# Altium schematic sheet MCU.SchDoc: Mini Editor Keyboard
size A3; DrawnBy: Roman Sklyar; Organization: S-LAB; Address1: Russian Federation; Address2: Sergiev Posad; DocumentNumber: 2; Revision: v1.0; SheetNumber: 2; SheetTotal: 6
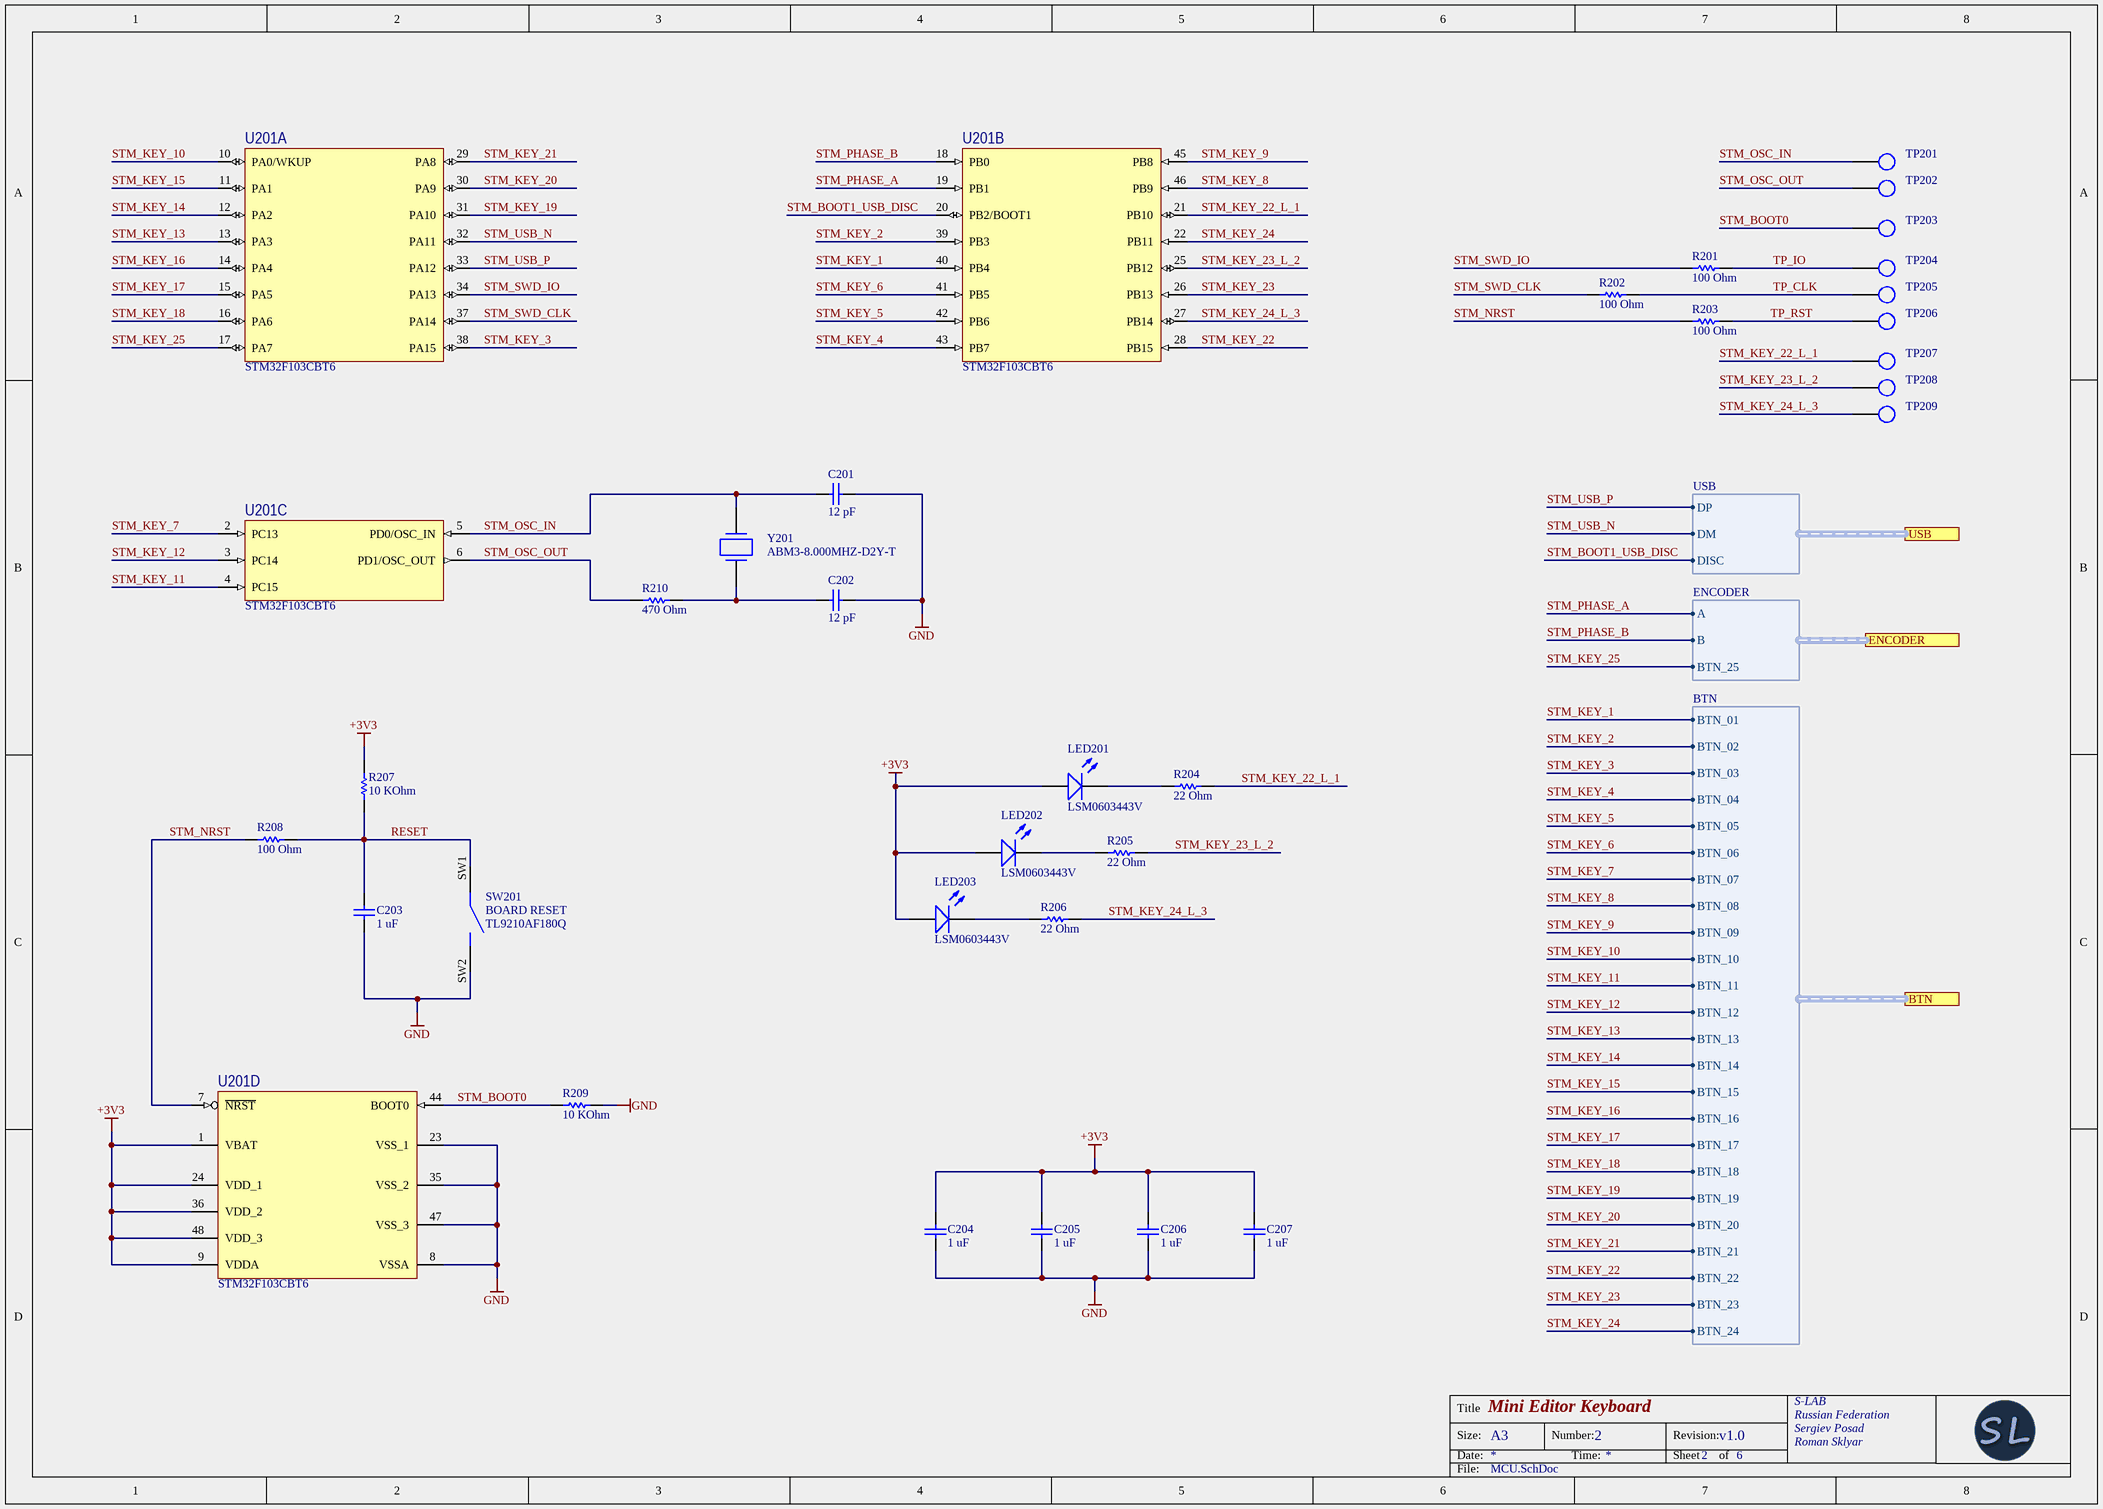
[diagram p0: MCU.SchDoc]

## Parts
C201  Capacitance: 12 pF  [CAPC0603]  (hidden comment: CAP-12P)
C202  Capacitance: 12 pF  [CAPC0603]  (hidden comment: CAP-12P)
C203  Capacitance: 1 uF  [CAPC0805]  (hidden comment: CAP-1U)
C204  Capacitance: 1 uF  [CAPC0805]  (hidden comment: CAP-1U)
C205  Capacitance: 1 uF  [CAPC0805]  (hidden comment: CAP-1U)
C206  Capacitance: 1 uF  [CAPC0805]  (hidden comment: CAP-1U)
C207  Capacitance: 1 uF  [CAPC0805]  (hidden comment: CAP-1U)
LED201  LSM0603443V  [LSM0603-Series]
LED202  LSM0603443V  [LSM0603-Series]
LED203  LSM0603443V  [LSM0603-Series]
R201  Resistance: 100 Ohm  [RES0603]  (hidden comment: RES-100)
R202  Resistance: 100 Ohm  [RES0603]  (hidden comment: RES-100)
R203  Resistance: 100 Ohm  [RES0603]  (hidden comment: RES-100)
R204  Resistance: 22 Ohm  [RES0603]  (hidden comment: RES-22)
R205  Resistance: 22 Ohm  [RES0603]  (hidden comment: RES-22)
R206  Resistance: 22 Ohm  [RES0603]  (hidden comment: RES-22)
R207  Resistance: 10 KOhm  [RES0603]  (hidden comment: RES-10K)
R208  Resistance: 100 Ohm  [RES0603]  (hidden comment: RES-100)
R209  Resistance: 10 KOhm  [RES0603]  (hidden comment: RES-10K)
R210  Resistance: 470 Ohm  [RES0603]  (hidden comment: RES-470)
SW201  BOARD RESET  [TL9210AF180Q]
TP201  (no value)  [TP_C-0.5mm]  (no BOM)
TP202  (no value)  [TP_C-0.5mm]  (no BOM)
TP203  (no value)  [TP_C-0.5mm]  (no BOM)
TP204  (no value)  [TP_C-0.5mm]  (no BOM)
TP205  (no value)  [TP_C-0.5mm]  (no BOM)
TP206  (no value)  [TP_C-0.5mm]  (no BOM)
TP207  (no value)  [TP_C-0.5mm]  (no BOM)
TP208  (no value)  [TP_C-0.5mm]  (no BOM)
TP209  (no value)  [TP_C-0.5mm]  (no BOM)
U201  STM32F103CBT6  [LQFP-48-STM32]  (parts A,B,C,D of 4)
Y201  ABM3-8.000MHZ-D2Y-T  [ABM3-2P]

## Ports
BTN (harness BTN), ENCODER (harness ENCODER), USB (harness USB)

## Harnesses
BTN: BTN_10, BTN_11, BTN_09, BTN_12, BTN_13, BTN_14, BTN_15, BTN_16, BTN_17, BTN_18, BTN_19, BTN_08, BTN_07, BTN_06, BTN_05, BTN_04, BTN_03, BTN_02, BTN_01, BTN_20, BTN_21, BTN_22, BTN_23, BTN_24
USB: DP, DM, DISC
ENCODER: A, B, BTN_25

## Nets
+3V3: C204.2 C205.2 C206.2 C207.2 LED201.2(A) LED202.2(A) LED203.2(A) R207.2 U201.1(VBAT) U201.9(VDDA) U201.24(VDD_1) U201.36(VDD_2) U201.48(VDD_3)
GND: C201.1 C202.1 C203.2 C204.1 C205.1 C206.1 C207.1 R209.2 SW201.SW2 U201.8(VSSA) U201.23(VSS_1) U201.35(VSS_2) U201.47(VSS_3)
RESET: C203.1 R207.1 R208.2 SW201.SW1
STM_BOOT0: R209.1 TP203.1 U201.44(BOOT0)
STM_BOOT1_USB_DISC: U201.20(PB2/BOOT1) ; port USB.DISC
STM_KEY_1: U201.40(PB4) ; port BTN.BTN_01
STM_KEY_2: U201.39(PB3) ; port BTN.BTN_02
STM_KEY_3: U201.38(PA15) ; port BTN.BTN_03
STM_KEY_4: U201.43(PB7) ; port BTN.BTN_04
STM_KEY_5: U201.42(PB6) ; port BTN.BTN_05
STM_KEY_6: U201.41(PB5) ; port BTN.BTN_06
STM_KEY_7: U201.2(PC13) ; port BTN.BTN_07
STM_KEY_8: U201.46(PB9) ; port BTN.BTN_08
STM_KEY_9: U201.45(PB8) ; port BTN.BTN_09
STM_KEY_10: U201.10(PA0/WKUP) ; port BTN.BTN_10
STM_KEY_11: U201.4(PC15) ; port BTN.BTN_11
STM_KEY_12: U201.3(PC14) ; port BTN.BTN_12
STM_KEY_13: U201.13(PA3) ; port BTN.BTN_13
STM_KEY_14: U201.12(PA2) ; port BTN.BTN_14
STM_KEY_15: U201.11(PA1) ; port BTN.BTN_15
STM_KEY_16: U201.14(PA4) ; port BTN.BTN_16
STM_KEY_17: U201.15(PA5) ; port BTN.BTN_17
STM_KEY_18: U201.16(PA6) ; port BTN.BTN_18
STM_KEY_19: U201.31(PA10) ; port BTN.BTN_19
STM_KEY_20: U201.30(PA9) ; port BTN.BTN_20
STM_KEY_21: U201.29(PA8) ; port BTN.BTN_21
STM_KEY_22: U201.28(PB15) ; port BTN.BTN_22
STM_KEY_22_L_1: R204.2 TP207.1 U201.21(PB10)
STM_KEY_23: U201.26(PB13) ; port BTN.BTN_23
STM_KEY_23_L_2: R205.2 TP208.1 U201.25(PB12)
STM_KEY_24: U201.22(PB11) ; port BTN.BTN_24
STM_KEY_24_L_3: R206.2 TP209.1 U201.27(PB14)
STM_KEY_25: U201.17(PA7) ; port ENCODER.BTN_25
STM_NRST: R203.1 R208.1 U201.7(~{NRST})
STM_OSC_IN: C201.2 TP201.1 U201.5(PD0/OSC_IN) Y201.2(OSC2)
STM_OSC_OUT: R210.1 TP202.1 U201.6(PD1/OSC_OUT)
STM_PHASE_A: U201.19(PB1) ; port ENCODER.A
STM_PHASE_B: U201.18(PB0) ; port ENCODER.B
STM_SWD_CLK: R202.1 U201.37(PA14)
STM_SWD_IO: R201.1 U201.34(PA13)
STM_USB_N: U201.32(PA11) ; port USB.DM
STM_USB_P: U201.33(PA12) ; port USB.DP
TP_CLK: R202.2 TP205.1
TP_IO: R201.2 TP204.1
TP_RST: R203.2 TP206.1
NetC202_2: C202.2 R210.2 Y201.1(OSC1)
NetLED201_1: LED201.1(K) R204.1
NetLED202_1: LED202.1(K) R205.1
NetLED203_1: LED203.1(K) R206.1

## Notes on the sheet
- Title
- Size:
- Date:
- A3
- Number:
- Time:
- Revision:
- Sheet
- of
- File:

## Library data of the parts
C201 C202 = CAP-12P: Chip Capacitor, 12 pF, +/- 5%; Voltage Rating: 50 V; Mount: Surface Mount; Tolerance: 5 %; Type: Capacitor
C203-C207 = CAP-1U: Chip Capacitor, 1 uF, +/- 5%; Voltage Rating: 50 V; Mount: Surface Mount; Tolerance: 5 %; Type: Capacitor
LED201-LED203 = LSM0603443V: White LED 0603 3V 20mA; Mount: Surface Mount; Type: LED; Color: White; PartNumber: LSM0603443V
R201-R203 R208 = RES-100: Chip Resistor, 100 Ohm, +/- 1%; Voltage Rating: 50 V; Mount: Surface Mount; Tolerance: 1 %; Type: Resistor
R204-R206 = RES-22: Chip Resistor, 22 Ohm, +/- 1%; Voltage Rating: 50 V; Mount: Surface Mount; Tolerance: 1 %; Type: Resistor
R207 R209 = RES-10K: Chip Resistor, 10 KOhm, +/- 1%; Voltage Rating: 50 V; Mount: Surface Mount; Tolerance: 1 %; Type: Resistor
R210 = RES-470: Chip Resistor, 470 Ohm, +/- 1%; Voltage Rating: 50 V; Mount: Surface Mount; Tolerance: 1 %; Type: Resistor
SW201 = TL9210AF180Q: SMD Tactile Switch, SPST, 180 gf, 12 VDC, 50 mA; Type: Tactile Switch Soft; Mount: Surface Mount; Model: TL9210AF180Q
TP201-TP209 = TestPad
U201 = STM32F103C8T6: ARM based 32-bit MCU with 64 or 128 KB Flash; Digit: 32 bit; Type: Microcontroller; Mount: Surface Mount; PartNumber: STM32F103CBT6
Y201 = ABM3-8.000MHZ-D2Y-T: 8MHz ±20ppm 18pF 140 Ohm SMD Crystal Resonators; Type: Quartz Crystal Resonator; Mount: Surface Mount; Frequency: 8 MHz; PartNumber: ABM3-8.000MHZ-D2Y-T